# Altium schematic sheet mixer_1GHz_rat_race_discreto.SchDoc
size A4
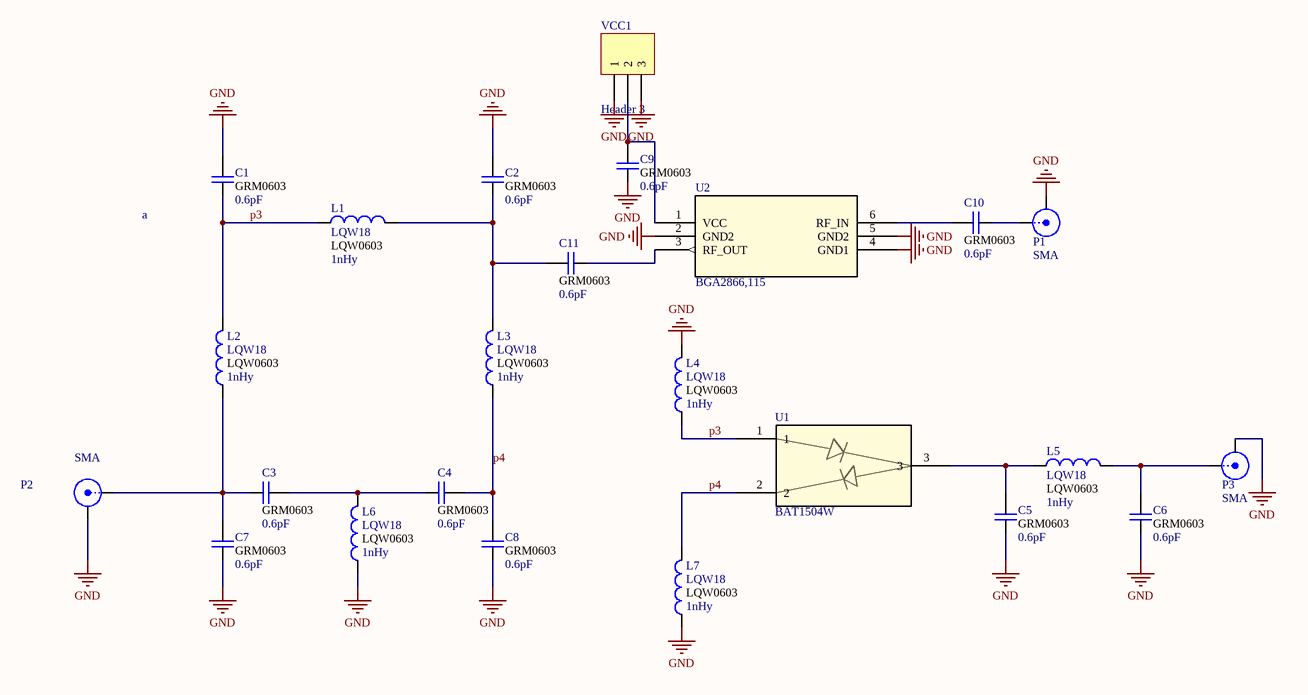
[diagram p0: mixer_1GHz_rat_race_discreto.SchDoc]

## Parts
C1  value 0.6pF  footprint: GRM0603  [CAPC1608X90N]  (hidden comment: Cap 0603)
C2  value 0.6pF  footprint: GRM0603  [CAPC1608X90N]  (hidden comment: Cap 0603)
C3  value 0.6pF  footprint: GRM0603  [CAPC1608X90N]  (hidden comment: Cap 0603)
C4  value 0.6pF  footprint: GRM0603  [CAPC1608X90N]  (hidden comment: Cap 0603)
C5  value 0.6pF  footprint: GRM0603  [CAPC1608X90N]  (hidden comment: Cap 0603)
C6  value 0.6pF  footprint: GRM0603  [CAPC1608X90N]  (hidden comment: Cap 0603)
C7  value 0.6pF  footprint: GRM0603  [CAPC1608X90N]  (hidden comment: Cap 0603)
C8  value 0.6pF  footprint: GRM0603  [CAPC1608X90N]  (hidden comment: Cap 0603)
C9  value 0.6pF  footprint: GRM0603  [CAPC1608X90N]  (hidden comment: Cap 0603)
C10  value 0.6pF  footprint: GRM0603  [CAPC1608X90N]  (hidden comment: Cap 0603)
C11  value 0.6pF  footprint: GRM0603  [CAPC1608X90N]  (hidden comment: Cap 0603)
L1  LQW18  value 1nHy  Parameter 1: LQW0603  [INDC1608X100N]
L2  LQW18  value 1nHy  Parameter 1: LQW0603  [INDC1608X100N]
L3  LQW18  value 1nHy  Parameter 1: LQW0603  [INDC1608X100N]
L4  LQW18  value 1nHy  Parameter 1: LQW0603  [INDC1608X100N]
L5  LQW18  value 1nHy  Parameter 1: LQW0603  [INDC1608X100N]
L6  LQW18  value 1nHy  Parameter 1: LQW0603  [INDC1608X100N]
L7  LQW18  value 1nHy  Parameter 1: LQW0603  [INDC1608X100N]
P1  SMA  [SMA-142-0701-851_V2]
P2  SMA  [SMA-142-0701-851_V2]
P3  SMA  [SMA-142-0701-851_V2]
U1  BAT1504W  [SOT_327XTSA1_INF]
U2  BGA2866,115  [SOT363_NXP]
VCC1  Header 3  [HDR1X3]

## Nets
GND: C1.2 C2.2 C5.1 C6.1 C7.1 C8.1 C9.1 L4.2 L6.1 L7.1 P1.2(Y) P2.2(Y) P3.2(Y) U2.2(GND2) U2.4(GND1) U2.5(GND2) VCC1.1 VCC1.3
p3: C1.1 L1.1 L2.2 L4.1 U1.1
p4: C4.2 C8.2 L3.1 L7.2 U1.2
NetC2_1: C2.1 C11.2 L1.2 L3.2
NetC3_1: C3.1 C7.2 L2.1 P2.1(X)
NetC3_2: C3.2 C4.1 L6.2
NetC5_2: C5.2 L5.1 U1.3
NetC6_2: C6.2 L5.2 P3.1(X)
NetC9_2: C9.2 U2.1(VCC) VCC1.2
NetC10_1: C10.1 P1.1(X)
NetC10_2: C10.2 U2.6(RF_IN)
NetC11_1: C11.1 U2.3(RF_OUT)

## Notes on the sheet
- a

## Library data of the parts
C1-C11 = Cap: Capacitor GRM18 0603; Published: 8-Jun-2000; LatestRevisionDate: 17-Jul-2002; LatestRevisionNote: Re-released for DXP Platform.; PackageReference: POLAR0.8; Publisher: Altium Limited; PackageDescription: Polarized Capacitor; 2 Leads; Supplier 1: Mouser
L1-L7 = LQW18: Ind RF Chip Wirewound 18nH 5% 100MHz 40Q-Factor 550mA 0603 Paper T/R; MP: LQW18AN18NJ00D; Package: None; Price: None; Availability: Unavailable
P1-P3 = SMB: SMB Straight Connector; LatestRevisionDate: 17-Jul-2002; LatestRevisionNote: Re-released for DXP Platform.; Publisher: Altium Limited
U1 = BAT1504W: Diodo; Mfr_Name: Infineon; RefDes: RefDes; Type: Type
U2 = BGA2866,115: No Description Available; Mfr_Name: NXP; RefDes: RefDes; Type: Type
VCC1 = Header 3: Header, 3-Pin; LatestRevisionDate: 17-Jul-2002; LatestRevisionNote: Re-released for DXP Platform.; Publisher: Altium Limited